# EAGLE design CFA_T (EAGLE 9.4.2)
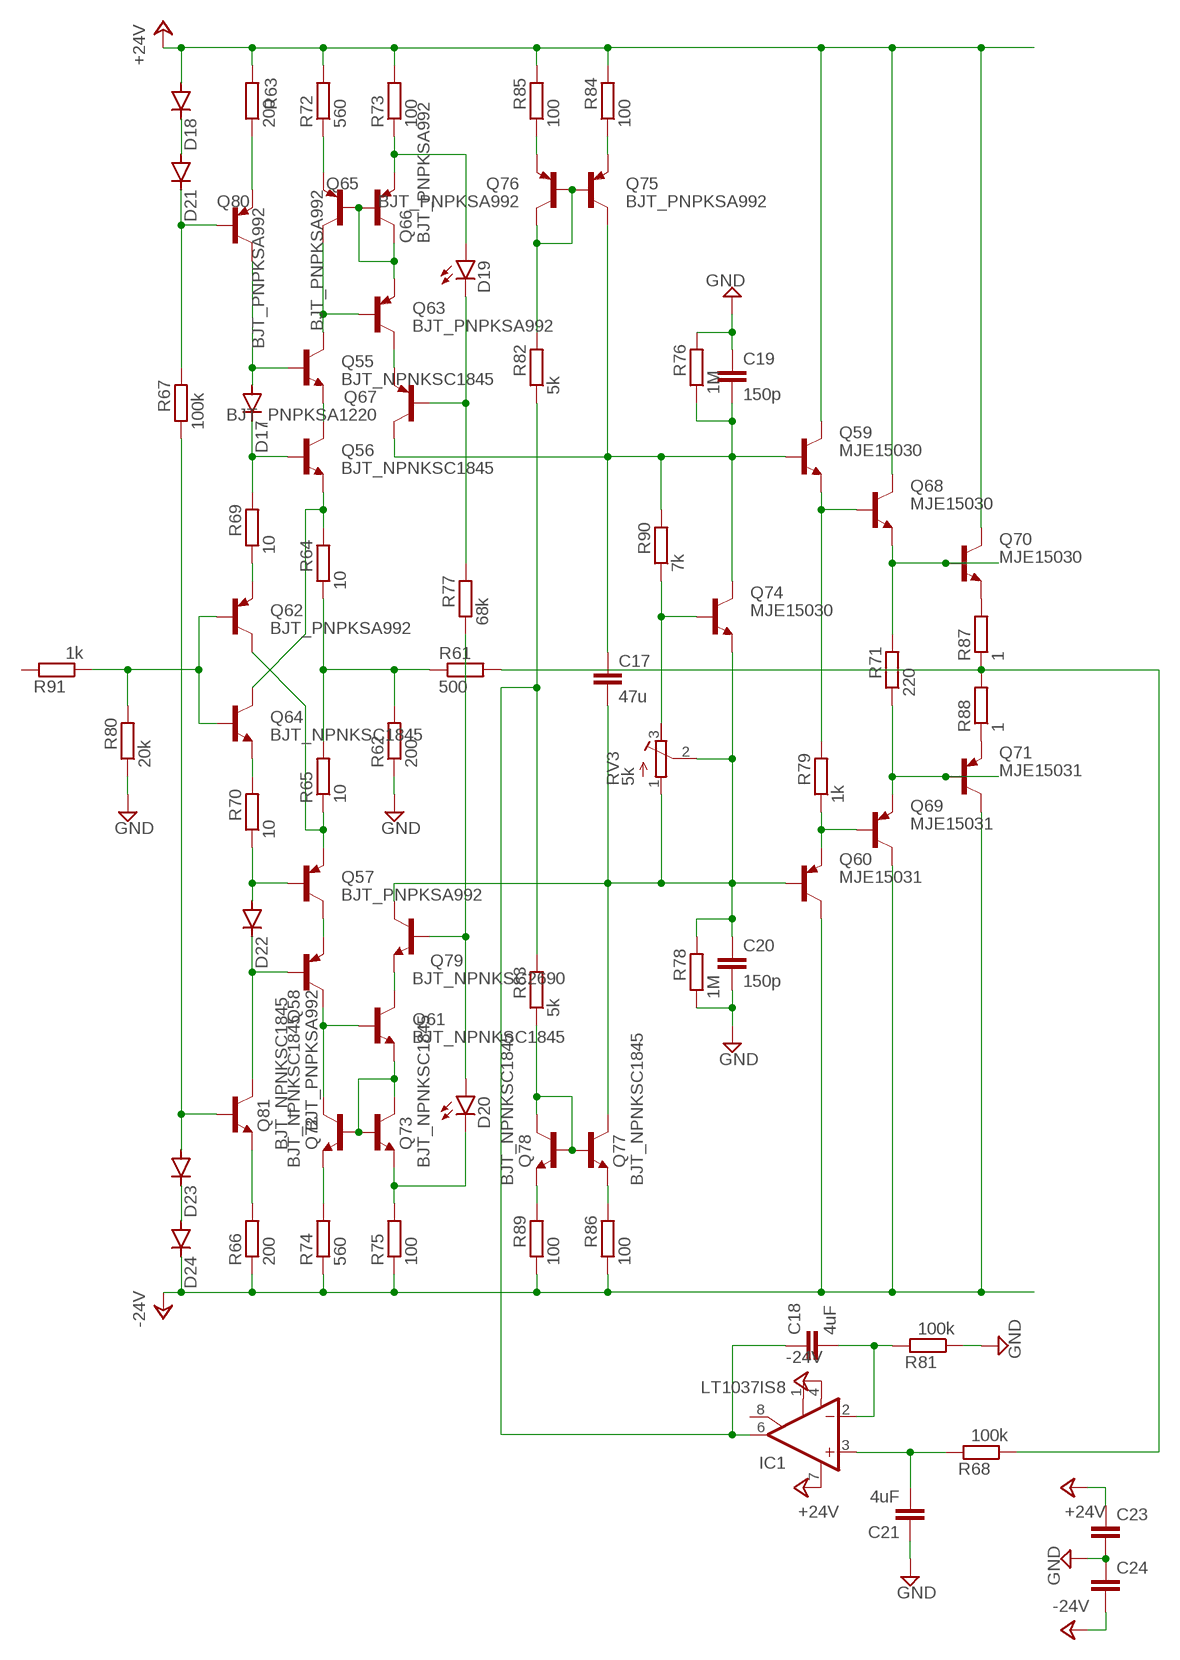
[diagram p0: schematic, sheet 1]

## Parts
C17  47u  C-EUC1210  [C1210]
C18  4uF  C-EUC1210  [C1210]
C19  150p  C-EUC0805  [C0805]
C20  150p  C-EUC0805  [C0805]
C21  4uF  C-EUC1210  [C1210]
C23  C-EUC0603K  [C0603K]
C24  C-EUC0603K  [C0603K]
D17  DIODE-SOD80C  [SOD80C]
D18  DIODE-SOD80C  [SOD80C]
D19  LEDCHIPLED_1206  [CHIPLED_1206]
D20  LEDCHIPLED_1206  [CHIPLED_1206]
D21  DIODE-SOD80C  [SOD80C]
D22  DIODE-SOD80C  [SOD80C]
D23  DIODE-SOD80C  [SOD80C]
D24  DIODE-SOD80C  [SOD80C]
IC1  LT1037IS8  [SOIC8]
Q55  BJT_NPNKSC1845  [TRANSISTOR_TO92-ECB]
Q56  BJT_NPNKSC1845  [TRANSISTOR_TO92-ECB]
Q57  BJT_PNPKSA992  [TRANSISTOR_TO92-ECB]
Q58  BJT_PNPKSA992  [TRANSISTOR_TO92-ECB]
Q59  MJE15030  BJT_NPNKSC1845  [TRANSISTOR_TO92-ECB]
Q60  MJE15031  BJT_PNPKSA992  [TRANSISTOR_TO92-ECB]
Q61  BJT_NPNKSC1845  [TRANSISTOR_TO92-ECB]
Q62  BJT_PNPKSA992  [TRANSISTOR_TO92-ECB]
Q63  BJT_PNPKSA992  [TRANSISTOR_TO92-ECB]
Q64  BJT_NPNKSC1845  [TRANSISTOR_TO92-ECB]
Q65  BJT_PNPKSA992  [TRANSISTOR_TO92-ECB]
Q66  BJT_PNPKSA992  [TRANSISTOR_TO92-ECB]
Q67  BJT_PNPKSA1220  [TRANSISTOR_TO126V]
Q68  MJE15030  BJT_NPNKSC1845  [TRANSISTOR_TO92-ECB]
Q69  MJE15031  BJT_PNPKSA992  [TRANSISTOR_TO92-ECB]
Q70  MJE15030  TO264_MJL4281  [TO264_TO-264]
Q71  MJE15031  TO264_MJL4302  [TO264_TO-264]
Q72  BJT_NPNKSC1845  [TRANSISTOR_TO92-ECB]
Q73  BJT_NPNKSC1845  [TRANSISTOR_TO92-ECB]
Q74  MJE15030  TRANSISTOR_MJE15030  [TRANSISTOR_TO220KG]
Q75  BJT_PNPKSA992  [TRANSISTOR_TO92-ECB]
Q76  BJT_PNPKSA992  [TRANSISTOR_TO92-ECB]
Q77  BJT_NPNKSC1845  [TRANSISTOR_TO92-ECB]
Q78  BJT_NPNKSC1845  [TRANSISTOR_TO92-ECB]
Q79  BJT_NPNKSC2690  [TRANSISTOR_TO126V]
Q80  BJT_PNPKSA992  [TRANSISTOR_TO92-ECB]
Q81  BJT_NPNKSC1845  [TRANSISTOR_TO92-ECB]
R61  500  R-EU_MELF0204W  [MINI_MELF-0204W]
R62  200  R-EU_MELF0204W  [MINI_MELF-0204W]
R63  200  R-EU_MELF0204W  [MINI_MELF-0204W]
R64  10  R-EU_MELF0204W  [MINI_MELF-0204W]
R65  10  R-EU_MELF0204W  [MINI_MELF-0204W]
R66  200  R-EU_MELF0204W  [MINI_MELF-0204W]
R67  100k  R-EU_MELF0204W  [MINI_MELF-0204W]
R68  100k  R-EU_MELF0204W  [MINI_MELF-0204W]
R69  10  R-EU_MELF0204W  [MINI_MELF-0204W]
R70  10  R-EU_MELF0204W  [MINI_MELF-0204W]
R71  220  R-EU_MELF0204W  [MINI_MELF-0204W]
R72  560  R-EU_MELF0204W  [MINI_MELF-0204W]
R73  100  R-EU_MELF0204W  [MINI_MELF-0204W]
R74  560  R-EU_MELF0204W  [MINI_MELF-0204W]
R75  100  R-EU_MELF0204W  [MINI_MELF-0204W]
R76  1M  R-EU_MELF0204W  [MINI_MELF-0204W]
R77  68k  R-EU_MELF0204W  [MINI_MELF-0204W]
R78  1M  R-EU_MELF0204W  [MINI_MELF-0204W]
R79  1k  R-EU_MELF0204W  [MINI_MELF-0204W]
R80  20k  R-EU_MELF0204W  [MINI_MELF-0204W]
R81  100k  R-EU_MELF0204W  [MINI_MELF-0204W]
R82  5k  R-EU_MELF0204W  [MINI_MELF-0204W]
R83  5k  R-EU_MELF0204W  [MINI_MELF-0204W]
R84  100  R-EU_MELF0204W  [MINI_MELF-0204W]
R85  100  R-EU_MELF0204W  [MINI_MELF-0204W]
R86  100  R-EU_MELF0204W  [MINI_MELF-0204W]
R87  1  R-EU_R2512  [R2512]
R88  1  R-EU_R2512  [R2512]
R89  100  R-EU_MELF0204W  [MINI_MELF-0204W]
R90  7k  R-EU_MELF0204W  [MINI_MELF-0204W]
R91  1k  R-EU_MELF0204W  [MINI_MELF-0204W]
RV3  5k  R-TRIMM3296W  [RTRIM3296W]

## Nets
+24V: C23.1 D18.A IC1.7(V+) Q59.C Q68.C Q70.C R63.2 R72.2 R73.2 R84.2 R85.2
-24V: C24.2 D24.C IC1.4(V-) Q60.C Q69.C Q71.C R66.1 R74.1 R75.1 R86.1 R89.1
GND: C19.1 C20.2 C21.1 C23.2 C24.1 R62.1 R76.2 R78.1 R80.1 R81.1
N$1: Q74.1(B) R90.1 RV3.3(E)
N$183: Q80.E R63.1
N$184: D17.A Q55.B Q80.C
N$185: D18.C D21.A
N$186: D21.C Q80.B R67.2
N$187: D17.C Q56.B R69.2
N$188: Q55.E Q56.C
N$189: Q56.E Q64.C R64.2
N$190: R61.1 R62.2 R64.1 R65.2
N$191: Q57.E Q62.C R65.1
N$192: D22.A Q57.B R70.1
N$193: D22.C Q58.B Q81.C
N$194: Q81.E R66.2
N$195: D23.C D24.A
N$196: Q57.C Q58.E
N$197: Q62.E R69.1
N$198: Q64.E R70.2
N$199: Q62.B Q64.B R80.2 R91.1
N$200: Q55.C Q63.B Q65.C
N$201: Q63.E Q65.B Q66.B Q66.C
N$202: Q65.E R72.1
N$203: D19.A Q66.E R73.1
N$204: Q63.C Q67.E
N$205: D19.C Q67.B R77.2
N$206: Q61.E Q72.B Q73.B Q73.C
N$207: D20.C Q73.E R75.2
N$208: Q72.E R74.2
N$209: Q58.C Q61.B Q72.C
N$210: Q61.C Q79.E
N$211: D20.A Q79.B R77.1
N$212: C17.1 C19.2 Q59.B Q67.C Q74.2(C) Q75.C R76.1 R90.2
N$213: Q75.B Q76.B Q76.C R82.2
N$214: Q77.B Q78.B Q78.C R83.1
N$215: Q76.E R85.1
N$216: Q75.E R84.1
N$217: C18.1 IC1.6(OUT) R82.1 R83.2
N$218: R61.2 R68.1 R87.1 R88.2
N$219: Q78.E R89.2
N$220: Q77.E R86.2
N$221: Q59.E Q68.B R79.2
N$222: Q60.E Q69.B R79.1
N$223: C17.2 C20.1 Q60.B Q74.3(E) Q77.C Q79.C R78.2 RV3.1(A) RV3.2(S)
N$224: Q68.E Q70.B R71.2
N$225: Q69.E Q71.B R71.1
N$226: Q70.E R87.2
N$227: Q71.E R88.1
N$228: C18.2 IC1.2(-IN) R81.2
N$229: C21.2 IC1.3(+IN) R68.2
N$230: D23.A Q81.B R67.1
Unconnected: IC1.1(CMP1) IC1.8(CMP2) R91.2

## Library data of the parts
C17-C21 = Vwvwbg:C-EU: CAPACITOR, European symbol; SPICEPREFIX: C
C23 C24 = Vwvwbg:C-EU: CAPACITOR, European symbol
D17 D18 D21-D24 = diode:DIODE-: DIODE; SPICEPREFIX: D
D19 D20 = led:LED: LED OSRAM: - CHIPLED LG R971, LG N971, LY N971, LG Q971, LY Q971, LO R971, LY R971 LH N974, LH R974 LS Q976, LO Q976, LY Q976 LO Q996 - Hyper CHIPLED LW Q18S LB Q993, LB Q99A, LB R99A - SideLED LS A670, LO A670, LY A670, LG A670, LP A670 LB A673, LV A673, LT A673, LW A673 LH A674 LY A675 LS A676, LA A676, LO A676, LY A676, LW A676 LS A679, LY A679, LG A679 - Hyper Micro SIDELED® LS Y876, LA Y876, LO Y876, LY Y876 LT Y87S - SmartLED LW L88C, LW L88S LB L89C, LB L89S, LG L890 LS L89K, LO L89K, LY L89K LS L896, LA L896, LO L896, LY L896 - TOPLED LS T670, LO T670, LY T670, LG T670, LP T670 LSG T670, LSP T670, LSY T670, LOP T670, LYG T670 LG T671, LOG T671, LSG T671 LB T673, LV T673, LT T673, LW T673 LH T674 LS T676, LA T676, LO T676, LY T676, LB T676, LH T676, LSB T676, LW T676 LB T67C, LV T67C, LT T67C, LS T67K, LO T67K, LY T67K, LW E67C LS E67B, LA E67B, LO E67B, LY E67B, LB E67C, LV E67C, LT E67C LW T67C LS T679, LY T679, LG T679 LS T770, LO T770, LY T770, LG T770, LP T770 LB T773, LV T773, LT T773, LW T773 LH T774 LS E675, LA E675, LY E675, LS T675 LS T776, LA T776, LO T776, LY T776, LB T776 LHGB T686 LT T68C, LB T68C - Hyper Mini TOPLED® LB M676 - Mini TOPLED Santana® LG M470 LS M47K, LO M47K, LY M47K Source: http://www.osram.convergy.de LUXEON: - LUMILED® LXK2-PW12-R00, LXK2-PW12-S00, LXK2-PW14-U00, LXK2-PW14-V00 LXK2-PM12-R00, LXK2-PM12-S00, LXK2-PM14-U00 LXK2-PE12-Q00, LXK2-PE12-R00, LXK2-PE12-S00, LXK2-PE14-T00, LXK2-PE14-U00 LXK2-PB12-K00, LXK2-PB12-L00, LXK2-PB12-M00, LXK2-PB14-N00, LXK2-PB14-P00, LXK2-PB14-Q00 LXK2-PR12-L00, LXK2-PR12-M00, LXK2-PR14-Q00, LXK2-PR14-R00 LXK2-PD12-Q00, LXK2-PD12-R00, LXK2-PD12-S00 LXK2-PH12-R00, LXK2-PH12-S00 LXK2-PL12-P00, LXK2-PL12-Q00, LXK2-PL12-R00 Source: www.luxeon.com KINGBRIGHT: KA-3528ASYC Source: www.kingbright.com; SPICEPREFIX: D
IC1 = Vwvwbg:LT10*: Low Noise, High Speed, Precision Operational Amplifiers Source: http://www.linear.com/pc/downloadDocument.do?navId=H0,C1,C1154,C1009,C1026,P1212,D2204
Q55 Q56 Q59 Q61 Q64 Q68 Q72 Q73 Q77-Q79 Q81 = Vwvwbg:BJT_NPN; SPICEPREFIX: Q
Q57 Q58 Q60 Q62 Q63 Q65-Q67 Q69 Q75 Q76 Q80 = Vwvwbg:BJT_PNP; SPICEPREFIX: Q
Q70 = Vwvwbg:TO264_MJL4281: MJL4281 NPN BCE TO-264; SPICEPREFIX: Q
Q71 = Vwvwbg:TO264_MJL4302: MJL4302 PNP BCE TO-264; SPICEPREFIX: Q
Q74 = Vwvwbg:TRANSISTOR_MJE15030; SPICEPREFIX: Q
R61-R91 = Vwvwbg:R-EU_: RESISTOR, European symbol; SPICEPREFIX: R
RV3 = rcl_mod:R-TRIMM: Trimm resistor; SPICEMODEL: X; SPICEPREFIX: Z; SPICEPREFIXL: POT

## Board
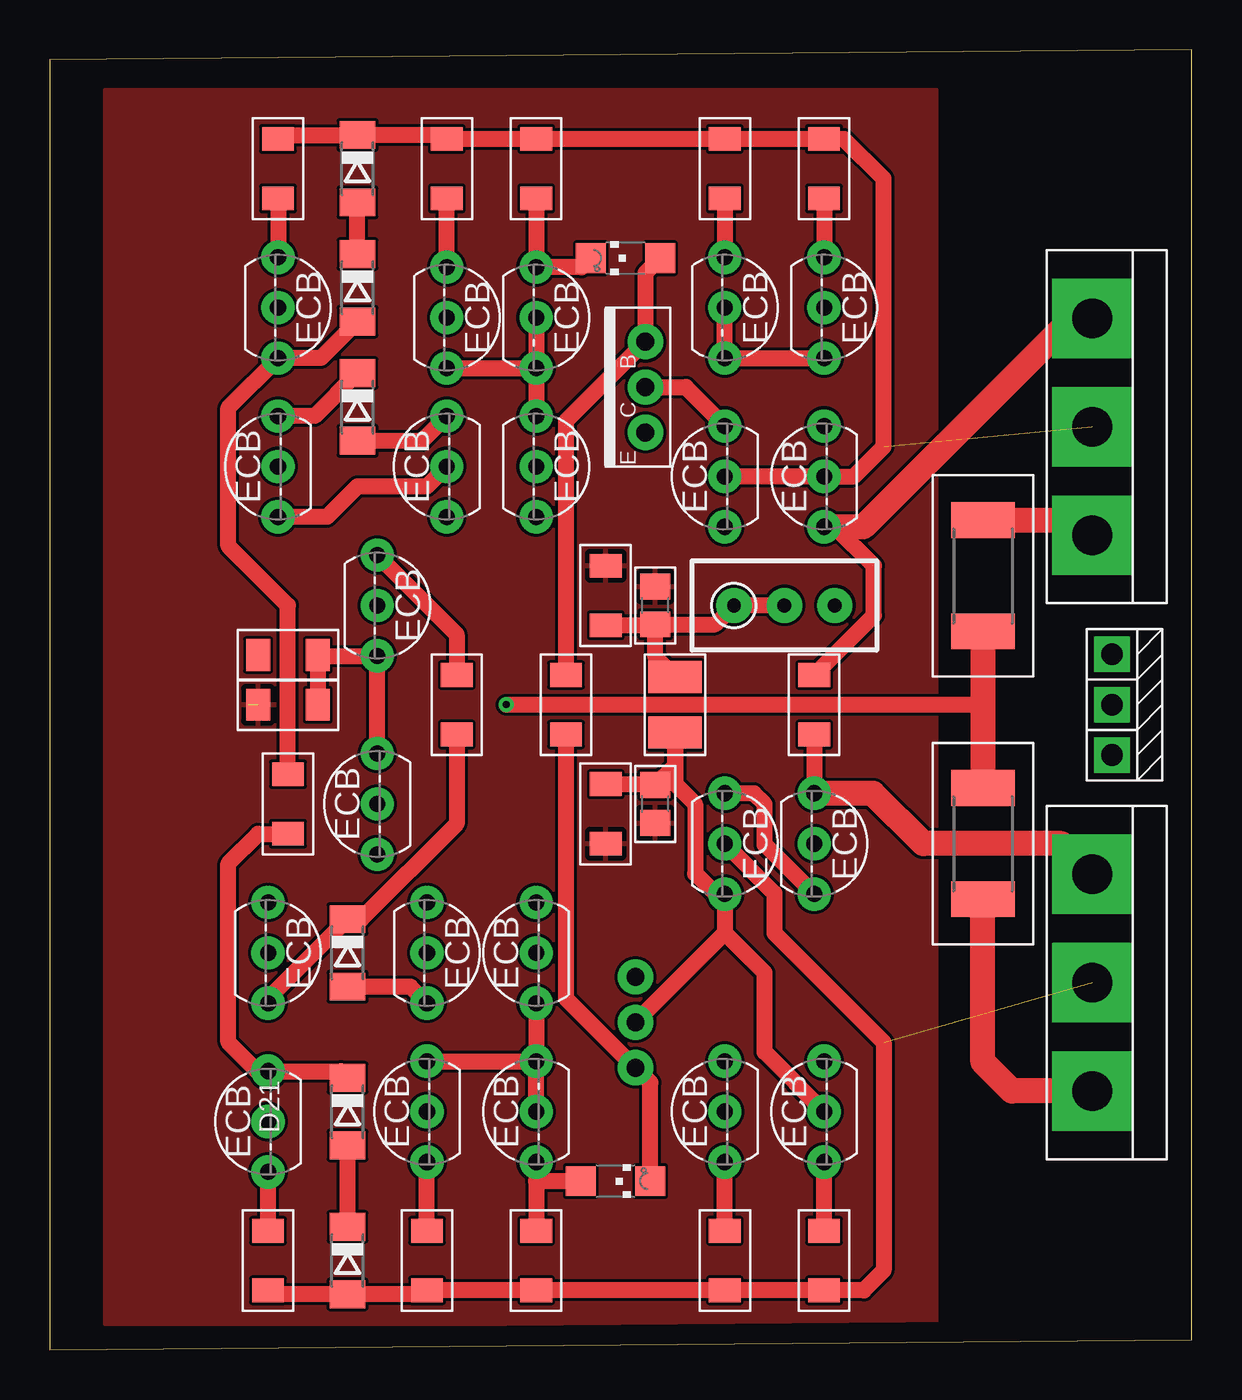
[diagram p1: board, top side]
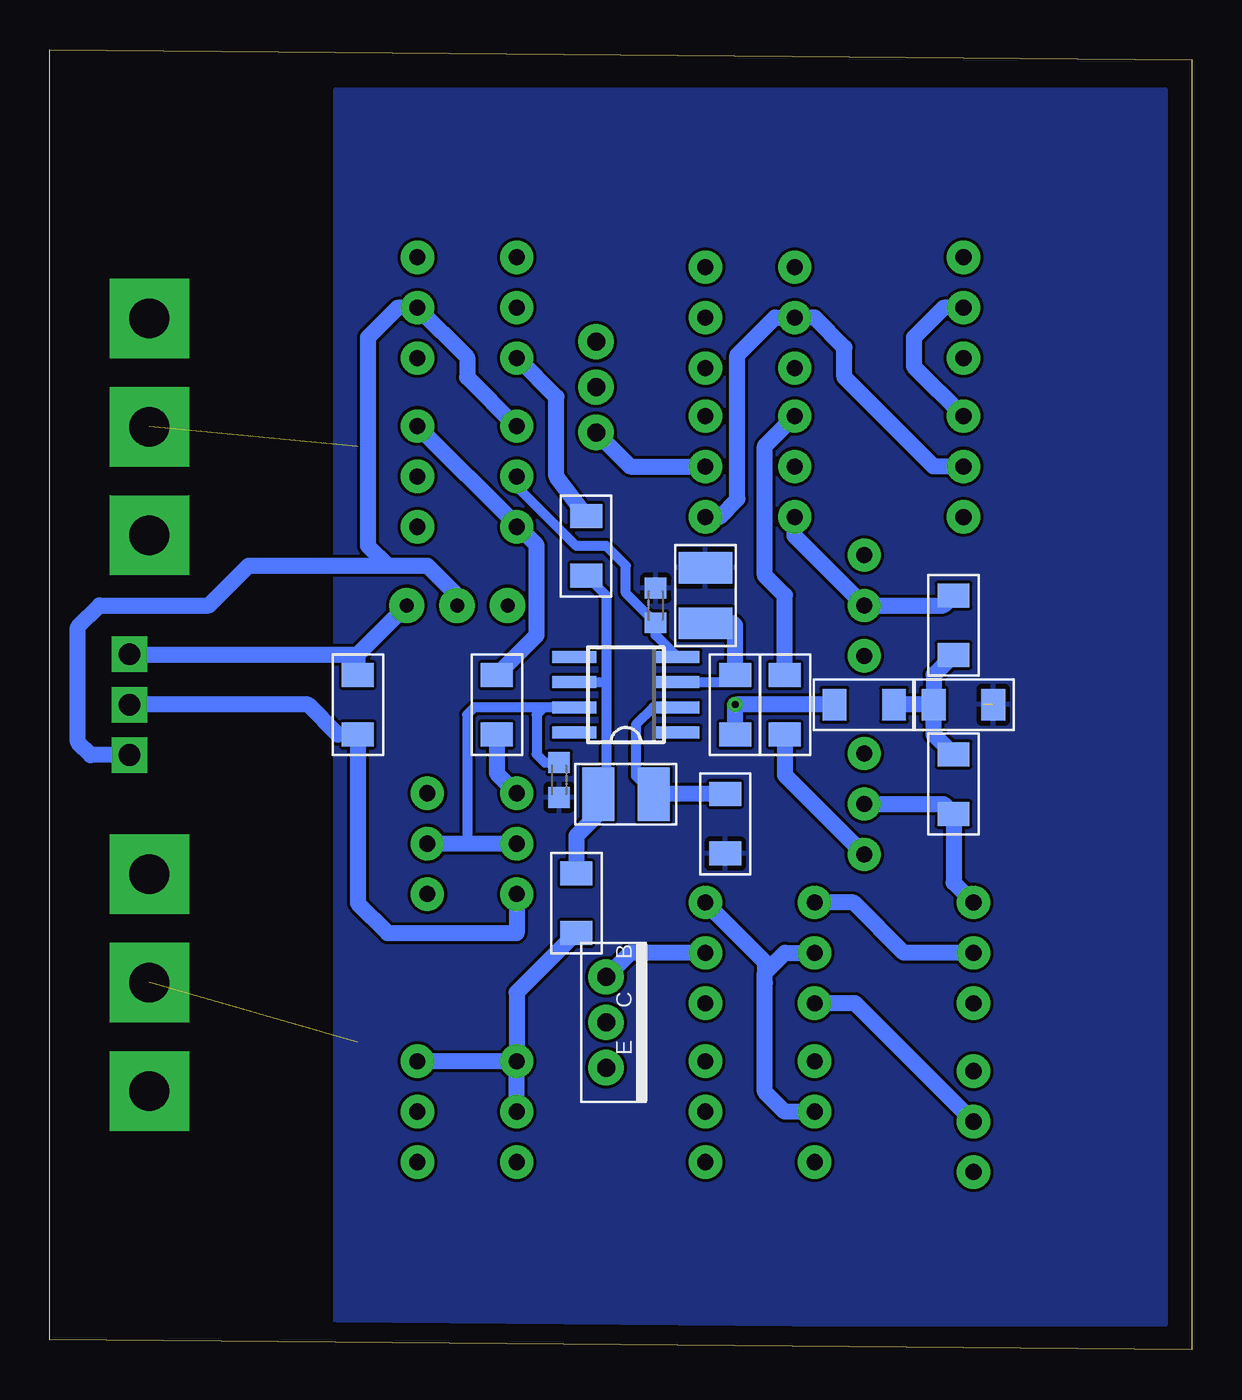
[diagram p2: board, bottom side, seen from below]

Size 57.52 x 65.5 mm. Coordinates in mm from the lower left corner, seen from the top.
Outline: 0,0 57.52,0.5 57.52,65.5 0,65 0,0
Copper layers (1*16): Top 0.035mm / dielectric 1.5mm / Bottom 0.035mm
Design rules "default *": minimum track width 6mil, minimum drill 0.35mm, track to track 6mil, track to pad 6mil, pad to pad 6mil, via to via 6mil, smd to smd 6mil, copper to edge 40mil, drill to drill 6mil, minimum pad ring 10mil, minimum via ring 8mil, stop-mask expansion 4mil, vias tented up to drill 0.35mm, thermal gap 10mil

### Footprints (pad centres in the part's own frame; a part is rotated, then mirrored left to right if it is on the bottom)
C1210 = smd 1.6 x 2.7: 1 -1.4,0; 2 1.4,0
C0805 = smd 1.3 x 1.5: 1 -0.95,0; 2 0.95,0
C0603K = smd 1.05 x 1.08: 1 -0.875,0; 2 0.875,0
SOD80C = smd 1.4 x 1.8: A 1.7,0; C -1.7,0
CHIPLED_1206 = smd 1.5 x 1.5: A 0,-1.75; C 0,1.75
SOIC8 = smd 0.6 x 2.2: 1 -1.905,-2.6; 2 -0.635,-2.6; 3 0.635,-2.6; 4 1.905,-2.6; 5 1.905,2.6; 6 0.635,2.6; 7 -0.635,2.6; 8 -1.905,2.6
TRANSISTOR_TO92-ECB = drill 0.813 pad 1.676: B 2.54,0; C 0,0; E -2.54,0
TRANSISTOR_TO126V = drill 0.9 pad 1.778: B 2.286,0; C 0,0; E -2.286,0
TO264_TO-264 = drill 2 pad 4 square: B -5.461,0; C 0,0; E 5.461,0
TRANSISTOR_TO220KG = drill 1.1 pad 1.778 square: 1 -2.54,0; 2 0,0; 3 2.54,0
MINI_MELF-0204W = smd 1.2 x 1.6: 1 -1.5,0; 2 1.5,0
R2512 = smd 1.8 x 3.2: 1 -2.8,0; 2 2.8,0
RTRIM3296W = drill 0.7 pad 1.778: 1 0,-2.54; 2 0,0; 3 0,2.54

### Placement (x,y rotation side)
C17  31.5,32.5 90 top
C18  28.5,28 0 bottom
C19  30.5,27.5 90 top
C20  30.5,37.5 90 top
C21  24.5,38 270 bottom
C23  31.86,28.71 270 bottom
C24  27,37.5 270 bottom
D17  15,20 270 top
D18  15,4.5 270 top
D19  28.5,8.5 270 top
D20  29,55 90 top
D21  15,12 270 top
D22  15.5,47.5 270 top
D23  15.5,53.5 270 top
D24  15.5,59.5 270 top
IC1  28.5,33 90 bottom
Q55  19,20 270 top
Q56  11,20 270 top
Q57  20,44.5 90 top
Q58  11.5,44.5 90 top
Q59  34,25.5 270 top
Q60  34,44 90 top
Q61  24.5,44.5 270 top
Q62  16.5,37.5 270 top
Q63  24.5,20 90 top
Q64  16.5,27.5 90 top
Q65  19,12 90 top
Q66  24.5,12 90 top
Q67  29.5,16.5 270 bottom
Q68  38.5,25.5 270 top
Q69  39,44 90 top
Q70  52.5,18.5 270 top
Q71  52.5,46.5 270 top
Q72  20,52 270 top
Q73  24.5,52 270 top
Q74  53.5,32.5 270 top
Q75  39,12 90 top
Q76  34,12 90 top
Q77  39,52.5 270 top
Q78  34,52.5 270 top
Q79  30,48.5 90 top
Q80  11,11.5 90 top
Q81  11.5,52.5 270 top
R61  16.5,32.5 180 bottom
R62  11.5,32.5 180 bottom
R63  11,4.5 270 top
R64  12,28.5 270 bottom
R65  12,36.5 270 bottom
R66  11.5,59.5 270 top
R67  12,27.5 270 top
R68  23,32.5 90 bottom
R69  20.5,32.5 270 top
R70  20.5,32.5 270 bottom
R71  38.5,32.5 270 top
R72  19,4.5 270 top
R73  24.5,4.5 270 top
R74  20,59.5 270 top
R75  24.5,59.5 270 top
R76  28,27 270 top
R77  26,32.5 270 top
R78  28,38 270 top
R79  35,32.5 270 bottom
R80  12,32.5 0 top
R81  23.5,26.5 90 bottom
R82  31,22.5 270 bottom
R83  30.5,40.5 270 bottom
R84  39,4.5 270 top
R85  34,4.5 270 top
R86  39,59.5 270 top
R87  47,25.5 270 top
R88  47,39 270 top
R89  34,59.5 270 top
R90  42,32.5 270 bottom
R91  12,35 180 top
RV3  37,37.5 270 top

### Tracks (layer width: path | path; a pad name or v marks a point on that pad's centre or on a via)
+24V  (1 unrouted)
  Top 0.813: Q59.C 36.5,23 36.5,21 42,15.5 42,4 41,3 R84.2 R85.2 R73.2 R72.2 18.8,2.8 D18.A 11.2,2.8 R63.2
  Bottom 0.508: IC1.7 32.63,32.37 | 32.63,32.37 33,32 33,30 32.59,29.59 C23.1 | 32.63,32.37 36.13,32.37 36.5,32 36.5,25.5
  Bottom 0.813: Q68.C 36.5,25.5 Q59.C
-24V  (1 unrouted)
  Top 0.813: Q60.C Q69.C 40.5,44 42,45.5 42,59 40,61 R86.1 R89.1 R75.1 19.7,61 19.5,61.2 | R66.1 11.7,61.2 D24.C 19.5,61.2 | 19.5,61.2 19.8,61.2 R74.1
  Bottom 0.508: IC1.4 27,36.01 C24.2 28.5,38.12 28.5,39.5 29.5,40.5 31,40.5 34,43.5 Q60.C
GND  (1 unrouted)
  pour Bottom: 1.27,63.5 43.18,63.5 43.18,1.27 1.27,1.27
  pour Top: 2.77,63.5 44.68,63.5 44.68,1.27 2.77,1.27
N$1
  Bottom 0.813: R90.1 42,35.04 | 42,35.04 RV3.3 | Q74.1 42,35.04
N$183
  Top 0.813: R63.1 Q80.E
N$184
  Top 0.813: D17.A 18.16,18.3 Q55.B
  Bottom 0.813: Q80.C 16.96,17.46 Q55.B
N$185
  Top 0.813: D18.C D21.A
N$186
  Top 0.813: D21.C 14.66,14.04 Q80.B 10.46,14.04 9,15.5 9,24.5 10.5,26 R67.2
N$187
  Top 0.813: R69.2 20.5,26.5 15.7,21.7 D17.C 11,17.7 Q56.B
N$188
  Bottom 0.813: Q55.E 17.04,22.54 14.5,20 Q56.C
N$189
  Bottom 0.813: Q64.C 12.5,27.5 R64.2 12,23.54 Q56.E
N$190
  Bottom 0.813: R65.2 13,34 R62.2 | R64.1 13,31 R62.2 | R62.2 R61.1
N$191
  Bottom 0.813: R65.1 12.5,37.5 Q62.C 20,41 Q57.E
N$192
  Top 0.813: D22.A 18.76,45.8 Q57.B
  Bottom 0.813: R70.1 20.5,38 21.5,39 21.5,45.54 Q57.B
N$193
  Top 0.813: D22.C 13.34,47.04 Q58.B
  Bottom 0.813: Q81.C 12.5,52.5 14,51 14,49.54 Q58.B
N$194
  Top 0.813: R66.2 Q81.E
N$195
  Top 0.813: D23.C D24.A
N$196
  Top 0.813: Q57.C 19,43.5 15.5,43.5 13.96,41.96 Q58.E
N$197
  Top 0.813: Q62.E 20.5,36.04 R69.1
N$198
  Bottom 0.813: R70.2 20.5,28.96 Q64.E
N$199
  Top 0.813: R80.2 R91.1 13.54,34.96 Q62.B Q64.B
N$200
  Bottom 0.813: Q65.C 20.5,12 21.5,13 21.5,18.5 21.5,19 | 21.5,19 20.5,20 Q55.C | Q63.B 21.5,19.54 21.5,19
N$201
  Top 0.813: Q65.B Q66.B | Q66.C Q66.B | Q63.E Q66.B
N$202
  Top 0.813: R72.1 Q65.E
N$203
  Top 0.813: Q66.E 24.5,8.5 | 24.5,8.5 R73.1 | D19.A 24.5,8.5
N$204
  Bottom 0.813: Q63.C 28.29,20 Q67.E
N$205
  Top 0.813: R77.2 26,17.71 Q67.B 30.25,13.46 D19.C
N$206
  Top 0.813: Q72.B Q73.B | Q73.C Q73.B | Q73.B Q61.E
N$207
  Top 0.813: R75.2 Q73.E 26.79,54.54 D20.C
N$208
  Top 0.813: Q72.E R74.2
N$209
  Bottom 0.813: Q58.C 13,44.5 17.5,49 17.5,50.5 19,52 Q72.C 21,52 22.88,50.12 22.88,42.86 23.79,41.96 Q61.B
N$210
  Bottom 0.813: Q79.E 28.29,44.5 Q61.C
N$211
  Top 0.813: D20.A 30,54.25 Q79.B 26,46.79 R77.1
N$212
  Top 0.813: R76.1 30.45,28.5 C19.2 31.5,29.45 C17.1 31.5,28.5 32.5,27.5 32.5,24 33.54,22.96 Q59.B 34,21 | 34,21 Q67.C | Q75.C 36,15 36,19 34,21
  Bottom 0.813: Q59.B 34,21 40.5,21 42,22.5 R90.2 43,31 44.5,32.5 Q74.2
N$213
  Bottom 0.813: R82.2 34,18 Q76.B | Q76.C Q76.B | Q76.B Q75.B
N$214
  Top 0.813: Q78.C Q78.B Q77.B
  Bottom 0.813: R83.1 32,44 32,48 33.96,49.96 Q78.B
N$215
  Top 0.813: R85.1 Q76.E
N$216
  Top 0.813: R84.1 Q75.E
N$217
  Bottom 0.508: C18.1 29.5,28.4 29.5,33.5 | IC1.6 29.64,33.63 29.5,33.5 | R83.2 29.5,38 29.5,33.5
  Bottom 0.813: C18.1 29.9,27 31,25.9 R82.1
N$218  (via drill 0.35)
  Top 0.813: v23,32.5 47,32.5 47,34.5
  Top 1.27: R88.2 47,34.5 R87.1
  Bottom 0.813: R61.2 v23,32.5 R68.1
N$219
  Top 0.813: R89.2 Q78.E
N$220
  Top 0.813: R86.2 Q77.E
N$221
  Top 0.813: Q68.B 36,25.46 36,27.5 35.46,28.04 Q59.E
  Bottom 0.813: R79.2 35,29.04 Q59.E
N$222
  Bottom 0.813: Q69.B 34,41.54 | 34,41.54 Q60.E | R79.1 33,36 33,40.54 34,41.54
N$223
  Top 0.813: RV3.2 RV3.1 33.51,36.55 C20.1 | C20.1 30.45,36.5 R78.2 | C17.2 30.5,34.9 C20.1 | Q79.C 32.04,48.5 Q60.B
  Bottom 0.813: Q60.B 34.04,46.54 36.5,49 36.5,50 Q77.C 40,52.5 41.5,51 41.5,40.5 40.5,39.5 | Q74.3 55.46,29.96 56.1,30.6 56.1,36.4 55,37.5 49.5,37.5 47.5,39.5 40.5,39.5 | 40.5,39.5 38.5,39.5 37,38 RV3.2
N$224
  Top 0.813: R71.2 Q68.E
  Top 1.27: Q70.B 50.96,25.5 44,25.5 41.46,28.04 Q68.E
N$225
  Top 0.813: R71.1 41.5,37 41.5,39.5 39.54,41.46 Q69.E
  Top 1.27: Q71.B 51.46,51.96 40.96,41.46 Q69.E
N$226
  Top 1.27: Q70.E 48.46,13.04 47,14.5 R87.2
N$227
  Top 1.27: R88.1 51.74,41.8 Q71.E
N$228
  Bottom 0.508: IC1.2 27.14,32.37 28,31.5 28,28.9 27.3,28.2
  Bottom 0.813: R81.2 C18.2 27.3,28.2
N$229
  Bottom 0.508: IC1.3 23.36,33.63 R68.2
  Bottom 0.813: R68.2 23,36.5 23.1,36.6 C21.2
N$230
  Top 0.813: D23.A 13.66,49.96 Q81.B 9,47.46 9,40.5 12,37.5 R67.1